# Altium schematic sheet LED-PCB_DIG3.SchDoc
size B; SheetNumber: 5; SheetTotal: 5
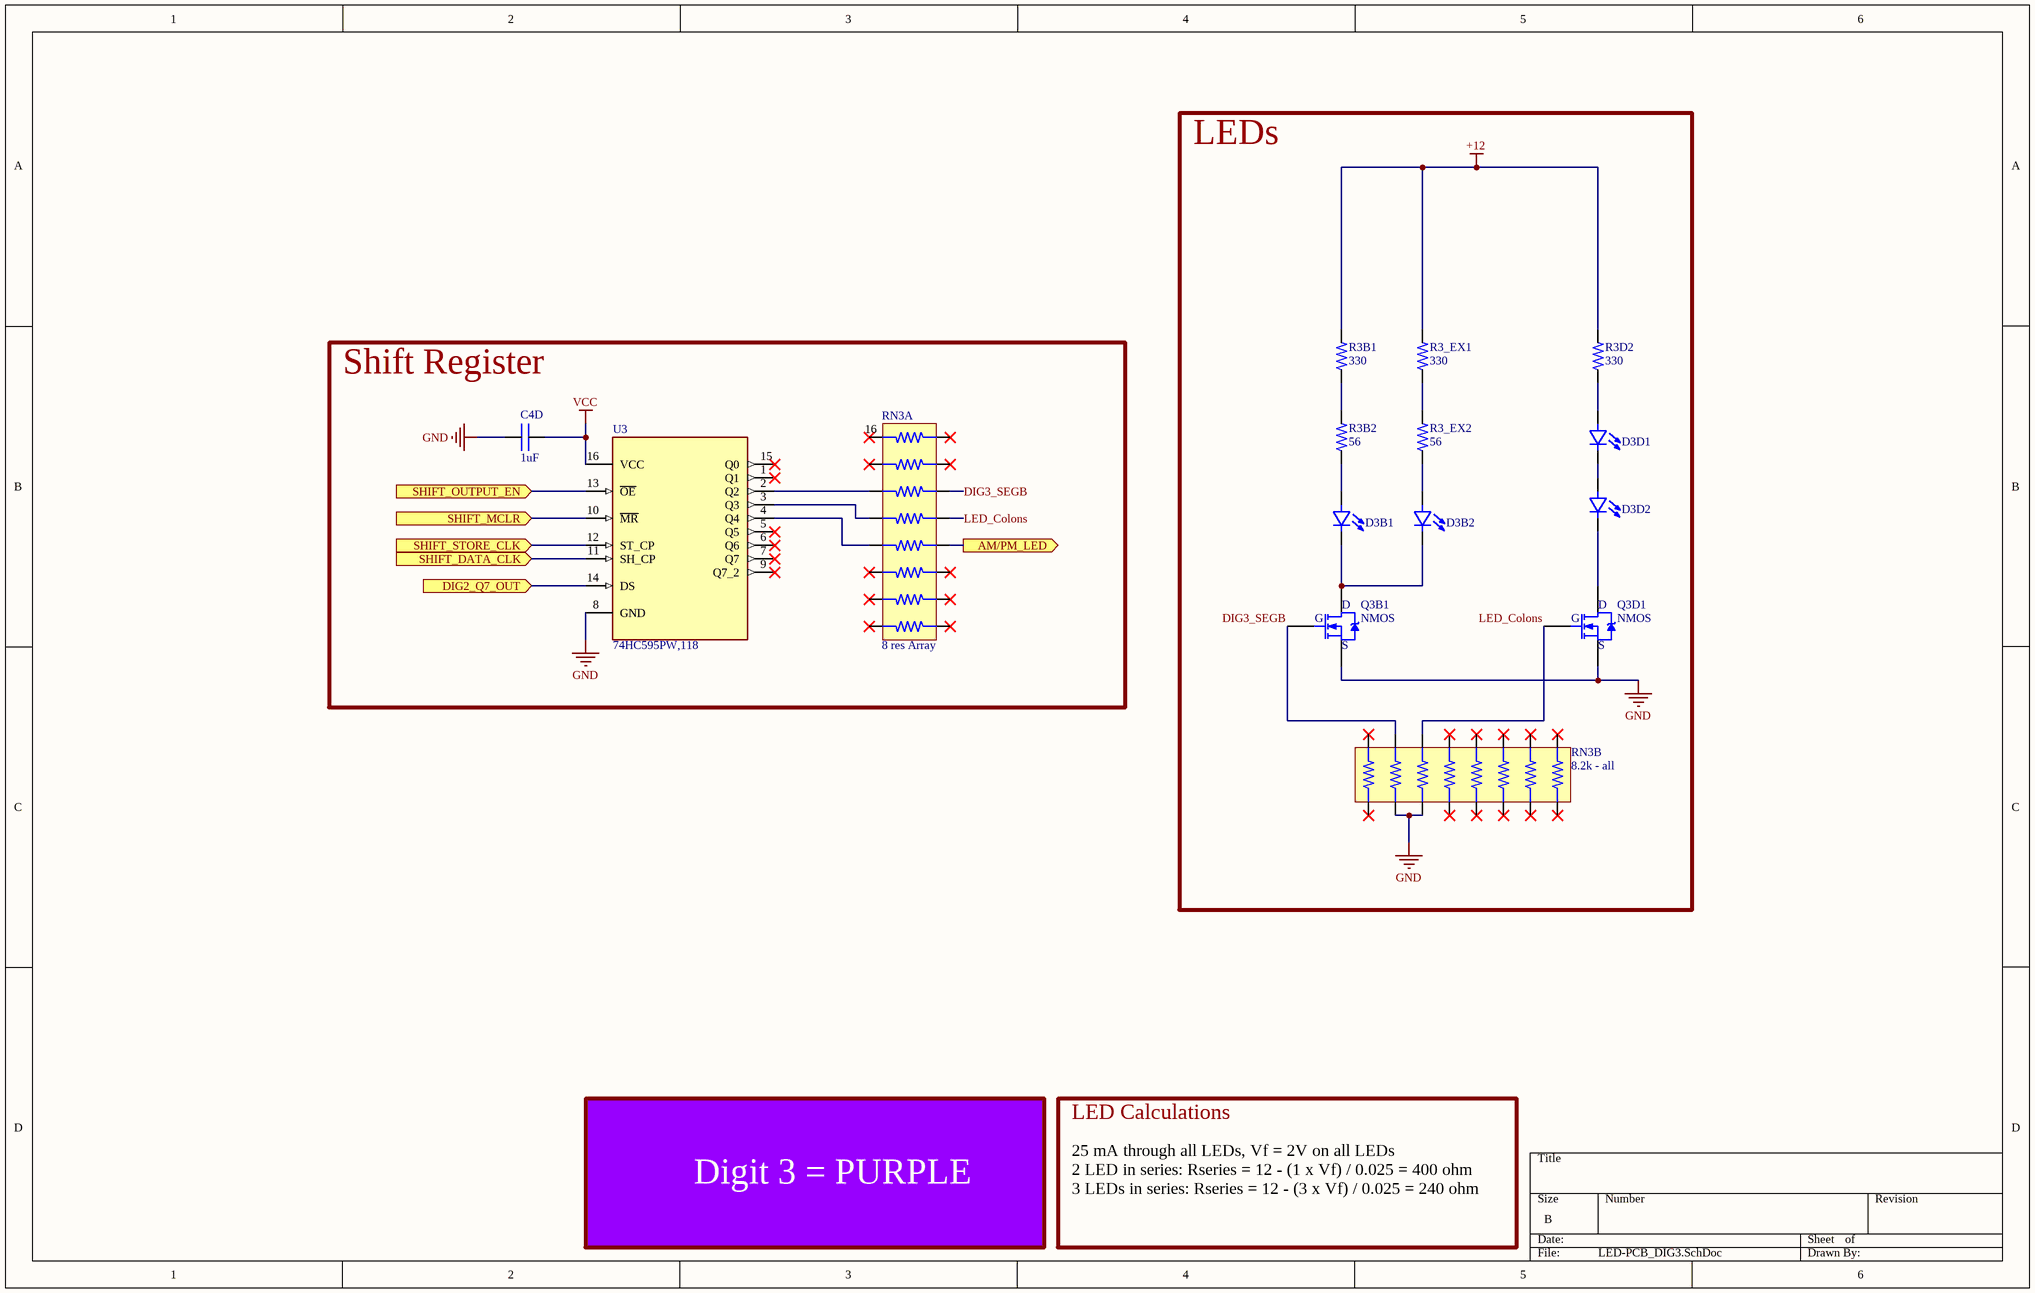
[diagram p0: LED-PCB_DIG3.SchDoc]

## Parts
C4D  value 1uF  [0402 CAP]  (hidden comment: CAP)
D3B1  LED - single  [LED - 0603]  (value not drawn)
D3B2  LED - single  [LED - 0603]  (value not drawn)
D3D1  LED - single  [LED - 0603]  (value not drawn)
D3D2  LED - single  [LED - 0603]  (value not drawn)
Q3B1  NMOS  [SOT-23]
Q3D1  NMOS  [SOT-23]
R3_EX1  value 330  [0402R]  (hidden comment: RES)
R3_EX2  value 56  [0402R]  (hidden comment: RES)
R3B1  value 330  [0402 RES]  (hidden comment: RES)
R3B2  value 56  [0402 RES]  (hidden comment: RES)
R3D2  value 330  [0402 RES]  (hidden comment: RES)
RN3A  8 res Array  [EXB2HV331JV]
RN3B  8.2k - all  [MNR18ERAPJ822]
U3  74HC595PW,118  [16-TSSOP]

## Blocks framed on the sheet
LEDs: D3B1 D3B2 D3D1 D3D2 Q3B1 Q3D1 R3_EX1 R3_EX2 R3B1 R3B2 R3D2 RN3B
Shift Register: C4D RN3A U3

## Ports
AM/PM_LED (out, see LED-PCB_Master[3B]), DIG2_Q7_OUT (in, see LED-PCB_Master[3B], LED-PCB_DIG2[4A]), SHIFT_DATA_CLK (in, see LED-PCB_Master[3B], LED-PCB_DIG0[3A], LED-PCB_DIG1[3A], LED-PCB_DIG2[3A]), SHIFT_MCLR (in, see LED-PCB_Master[3B], LED-PCB_DIG0[3A], LED-PCB_DIG1[3A], LED-PCB_DIG2[3A]), SHIFT_OUTPUT_EN (in, see LED-PCB_Master[3B], LED-PCB_DIG0[3A], LED-PCB_DIG1[3A], LED-PCB_DIG2[3A]), SHIFT_STORE_CLK (in, see LED-PCB_Master[3B], LED-PCB_DIG0[3A], LED-PCB_DIG1[3A], LED-PCB_DIG2[3A])

## Nets
+12: R3_EX1.2 R3B1.2 R3D2.2
GND: C4D.2 Q3B1.2(S) Q3D1.2(S) RN3B.2 RN3B.3 U3.8(GND)
VCC: C4D.1 U3.16(VCC)
AM/PM_LED: RN3A.5 ; port AM/PM_LED
DIG2_Q7_OUT: U3.14(DS) ; port DIG2_Q7_OUT
DIG3_SEGB: Q3B1.1(G) RN3A.3 RN3B.15
LED_Colons: Q3D1.1(G) RN3A.4 RN3B.14
SHIFT_DATA_CLK: U3.11(SH_CP) ; port SHIFT_DATA_CLK
SHIFT_MCLR: U3.10(~{MR}) ; port SHIFT_MCLR
SHIFT_OUTPUT_EN: U3.13(~{OE}) ; port SHIFT_OUTPUT_EN
SHIFT_STORE_CLK: U3.12(ST_CP) ; port SHIFT_STORE_CLK
NetD3B1_1: D3B1.1(A) R3B2.1
NetD3B1_2: D3B1.2(C) D3B2.2(C) Q3B1.3(D)
NetD3B2_1: D3B2.1(A) R3_EX2.1
NetD3D1_1: D3D1.1(A) R3D2.1
NetD3D1_2: D3D1.2(C) D3D2.1(A)
NetD3D2_2: D3D2.2(C) Q3D1.3(D)
NetR3_EX1_1: R3_EX1.1 R3_EX2.2
NetR3B1_1: R3B1.1 R3B2.2
NetRN3A_12: RN3A.12 U3.4(Q4)
NetRN3A_13: RN3A.13 U3.3(Q3)
NetRN3A_14: RN3A.14 U3.2(Q2)

Not connected (* = marked no-connect by the designer): RN3A 1* 2* 6* 7* 8* 9* 10* 11* 15* 16*; RN3B 1* 4* 5* 6* 7* 8* 9* 10* 11* 12* 13* 16*; U3 1(Q1)* 5(Q5)* 6(Q6)* 7(Q7)* 9(Q7_2)* 15(Q0)*

## Notes on the sheet
- LED Calculations
- Digit 3 = PURPLE
- 25 mA through all LEDs, Vf = 2V on all LEDs
  2 LED in series: Rseries = 12 - (1 x Vf) / 0.025 = 400 ohm
  3 LEDs in series: Rseries = 12 - (3 x Vf) / 0.025 = 240 ohm

## Library data of the parts
C4D = CAP: Capaicitor; MFR PN: CL05A105KP5NNNC; MFR: Samsung Microelectronics
D3B1 D3B2 D3D1 D3D2 = LED - single: MFR PN: 150060RS75000; MFR: Wurth Elektronik; Color: Red
Q3B1 Q3D1 = NMOS: N-Channel MOSFET; MFR PN: DMN63D8L-7; MFR: Diodes Incorporated
R3_EX1 R3B1 R3D2 = RES: Resistor; MFR PN: RC0402JR-13330RL; MFR: YAGEO
R3_EX2 R3B2 = RES: Resistor; MFR PN: RC0402FR-0756RL; MFR: YAGEO
RN3A = 8 res Array: MFR PN: EXB-2HV331JV; MFR: Panasonic Microelectronics; Value: 330; Vendor: *; Vendor PN: *; ComponentLink1Description: New link; ComponentLink1URL: *; ComponentLink2Description: New link 1; ComponentLink2URL: *; Vendor Link: *
RN3B = MNR18ERAPJ822: 8.2k Ohm ±5% 62.5mW Power Per Element Isolated 8 Resistor Network/Array ±250ppm/°C 1606, Convex, Long Side Terminals; MFR: Rohm Semiconductor; MFR PN: MNR18ERAPJ822
U3 = 74HC595PW,118: Shift Shift Register 1 Element 8 Bit 16-TSSOP; MFR PN: 74HC595PW,118; Nexperia USA: *